# Altium project BATT_ctrl_v3.PrjPcb
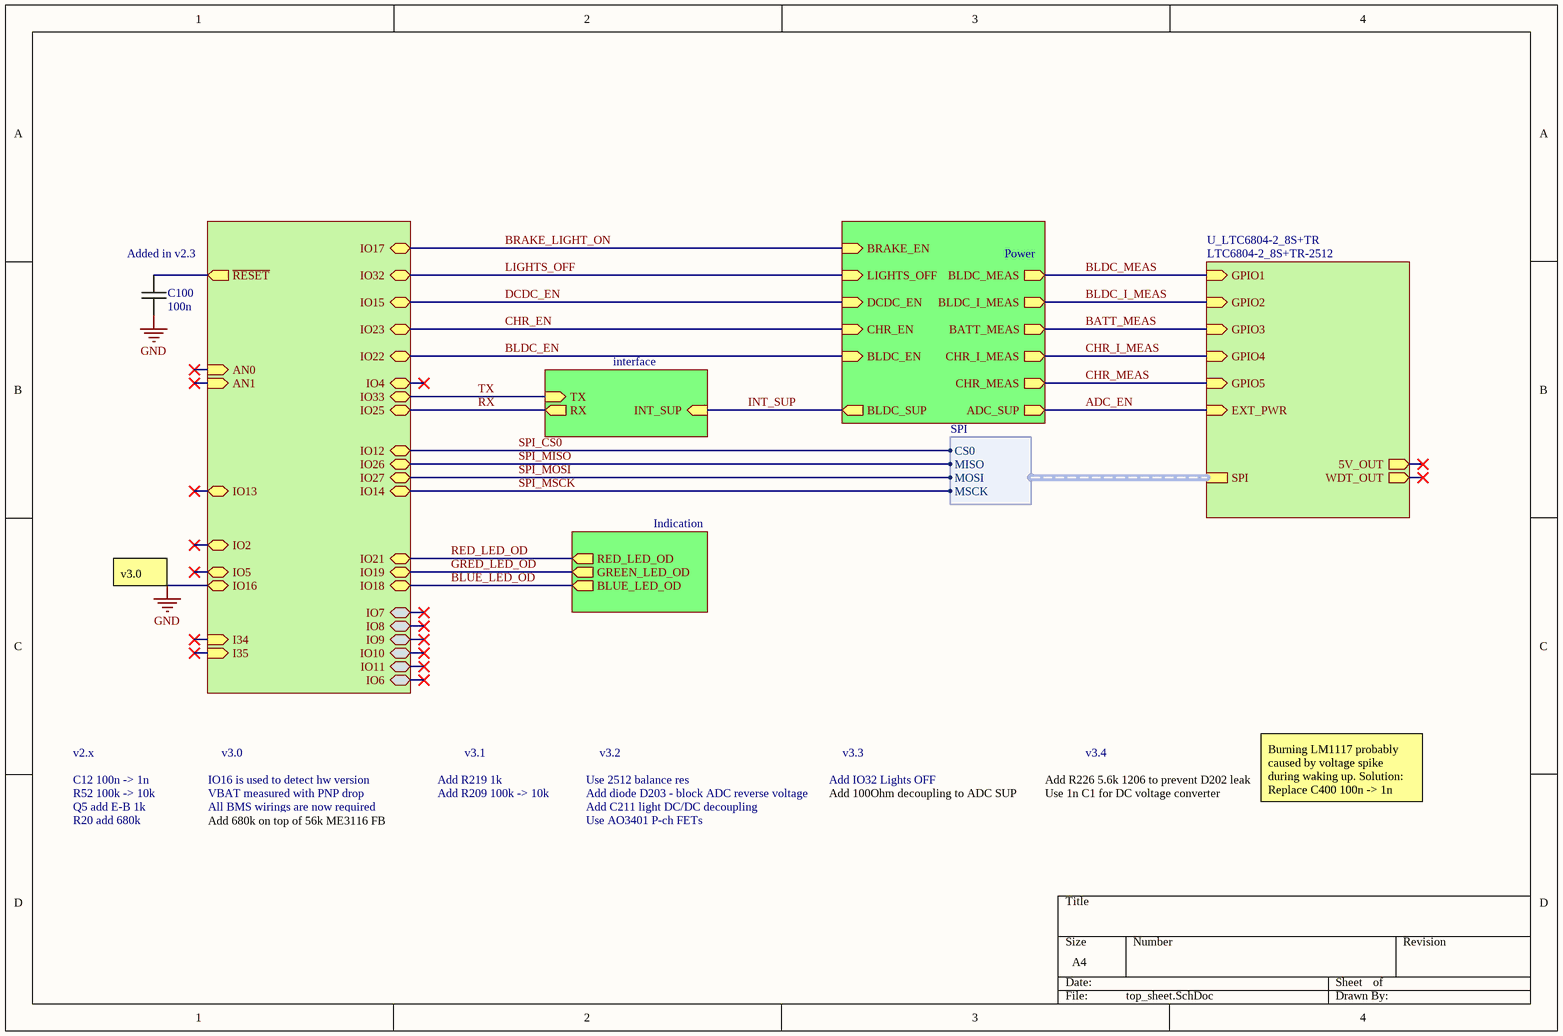
[diagram p0: top_sheet.SchDoc]
5 sheets, 78 parts. Net scope: hierarchical (ports join the sheet entries above them; power ports are global).
Board file: batt_ctrl_pcb_v3.4.PcbDoc
Sheets:
  top_sheet.SchDoc
    Power = power.SchDoc
    interface = data_interface.SchDoc
    Indication = indication.SchDoc
  OveralSchematic.SchDoc

## Sheet top_sheet.SchDoc
size A4; SheetNumber: 1; SheetTotal: 8

### Parts
C100  100n  [CAPC0603(1608)55_N]

### Sub-sheets
Indication = indication.SchDoc: RED_LED_OD (out), GREEN_LED_OD (out), BLUE_LED_OD (out)
interface = data_interface.SchDoc: TX (in), RX (out), INT_SUP (in)
Power = power.SchDoc: BLDC_EN (in), BLDC_I_MEAS (out), CHR_EN (in), CHR_I_MEAS (out), BLDC_MEAS (out), CHR_MEAS (out), BATT_MEAS (out), DCDC_EN (in), BLDC_SUP (out), ADC_SUP (out), LIGHTS_OFF (in), BRAKE_EN (in)
U_ESP32_WROOM2 = ESP32_WROOM2 (file not in this document): IO25 (bidir), IO26 (bidir), IO27 (bidir), IO22 (bidir), IO23 (bidir), IO32 (bidir), IO19 (bidir), IO21 (bidir), IO33 (bidir), IO14 (bidir), IO12 (bidir), IO15 (bidir), IO16 (bidir), IO17 (bidir), IO18 (bidir), IO13 (bidir), I34 (in), I35 (in), IO5 (bidir), IO4 (bidir), IO2 (bidir), AN0 (in), AN1 (in), IO7 (bidir), IO8 (bidir), IO9 (bidir), IO10 (bidir), IO11 (bidir), IO6 (bidir), ~{RESET} (out)
U_LTC6804-2_8S+TR = LTC6804-2_8S+TR-2512 (file not in this document): GPIO1 (in), GPIO2 (in), GPIO3 (in), GPIO4 (in), GPIO5 (in), SPI (harness SPI), EXT_PWR (in), 5V_OUT (out), WDT_OUT (out)

### Harnesses
SPI: CS0, MISO, MOSI, MSCK

### Nets
GND: C100.2 ; sheet U_ESP32_WROOM2/IO16
ADC_EN: sheet Power/BLDC_SUP, sheet Power/ADC_SUP, sheet interface/INT_SUP, sheet U_LTC6804-2_8S+TR/EXT_PWR  [also labelled INT_SUP]
BATT_MEAS: sheet Power/BATT_MEAS, sheet U_LTC6804-2_8S+TR/GPIO3
BLDC_EN: sheet U_ESP32_WROOM2/IO22, sheet Power/BLDC_EN
BLDC_I_MEAS: sheet Power/BLDC_I_MEAS, sheet U_LTC6804-2_8S+TR/GPIO2
BLDC_MEAS: sheet Power/BLDC_MEAS, sheet U_LTC6804-2_8S+TR/GPIO1
BLUE_LED_OD: sheet U_ESP32_WROOM2/IO18, sheet Indication/BLUE_LED_OD
BRAKE_LIGHT_ON: sheet U_ESP32_WROOM2/IO17, sheet Power/BRAKE_EN
CHR_EN: sheet U_ESP32_WROOM2/IO23, sheet Power/CHR_EN
CHR_I_MEAS: sheet Power/CHR_I_MEAS, sheet U_LTC6804-2_8S+TR/GPIO4
CHR_MEAS: sheet Power/CHR_MEAS, sheet U_LTC6804-2_8S+TR/GPIO5
DCDC_EN: sheet U_ESP32_WROOM2/IO15, sheet Power/DCDC_EN
GRED_LED_OD: sheet U_ESP32_WROOM2/IO19, sheet Indication/GREEN_LED_OD
LIGHTS_OFF: sheet U_ESP32_WROOM2/IO32, sheet Power/LIGHTS_OFF
RED_LED_OD: sheet U_ESP32_WROOM2/IO21, sheet Indication/RED_LED_OD
RX: sheet U_ESP32_WROOM2/IO25, sheet interface/RX
SPI_CS0: sheet U_ESP32_WROOM2/IO12, sheet U_LTC6804-2_8S+TR/SPI.CS0
SPI_MISO: sheet U_ESP32_WROOM2/IO26, sheet U_LTC6804-2_8S+TR/SPI.MISO
SPI_MOSI: sheet U_ESP32_WROOM2/IO27, sheet U_LTC6804-2_8S+TR/SPI.MOSI
SPI_MSCK: sheet U_ESP32_WROOM2/IO14, sheet U_LTC6804-2_8S+TR/SPI.MSCK
TX: sheet U_ESP32_WROOM2/IO33, sheet interface/TX
NetC100_1: C100.1 ; sheet U_ESP32_WROOM2/~{RESET}

### Notes on the sheet
- (near C100) Added in v2.3
- v3.0
- v2.x
- C12 100n -> 1n
- IO16 is used to detect hw version
- Add R219 1k
- v3.1
- Use 2512 balance res
- v3.2
- Add IO32 Lights OFF
- v3.3
- Add R226 5.6k 1206 to prevent D202 leak
- v3.4
- R52 100k -> 10k
- Q5 add E-B 1k
- R20 add 680k
- VBAT measured with PNP drop
- All BMS wirings are now required
- Add 680k on top of 56k ME3116 FB
- Add R209 100k -> 10k
- Add diode D203 - block ADC reverse voltage
- Add C211 light DC/DC decoupling
- Use AO3401 P-ch FETs
- Add 100Ohm decoupling to ADC SUP
- Use 1n C1 for DC voltage converter
- Burning LM1117 probably caused by voltage spike during waking up. Solution: Replace C400 100n -> 1n

### Library data of the parts
C100 = Capacitor M: Ceramic capacitor Medium density; Value: 100n

## Sheet power.SchDoc
size A4; SheetNumber: 2; SheetTotal: 8
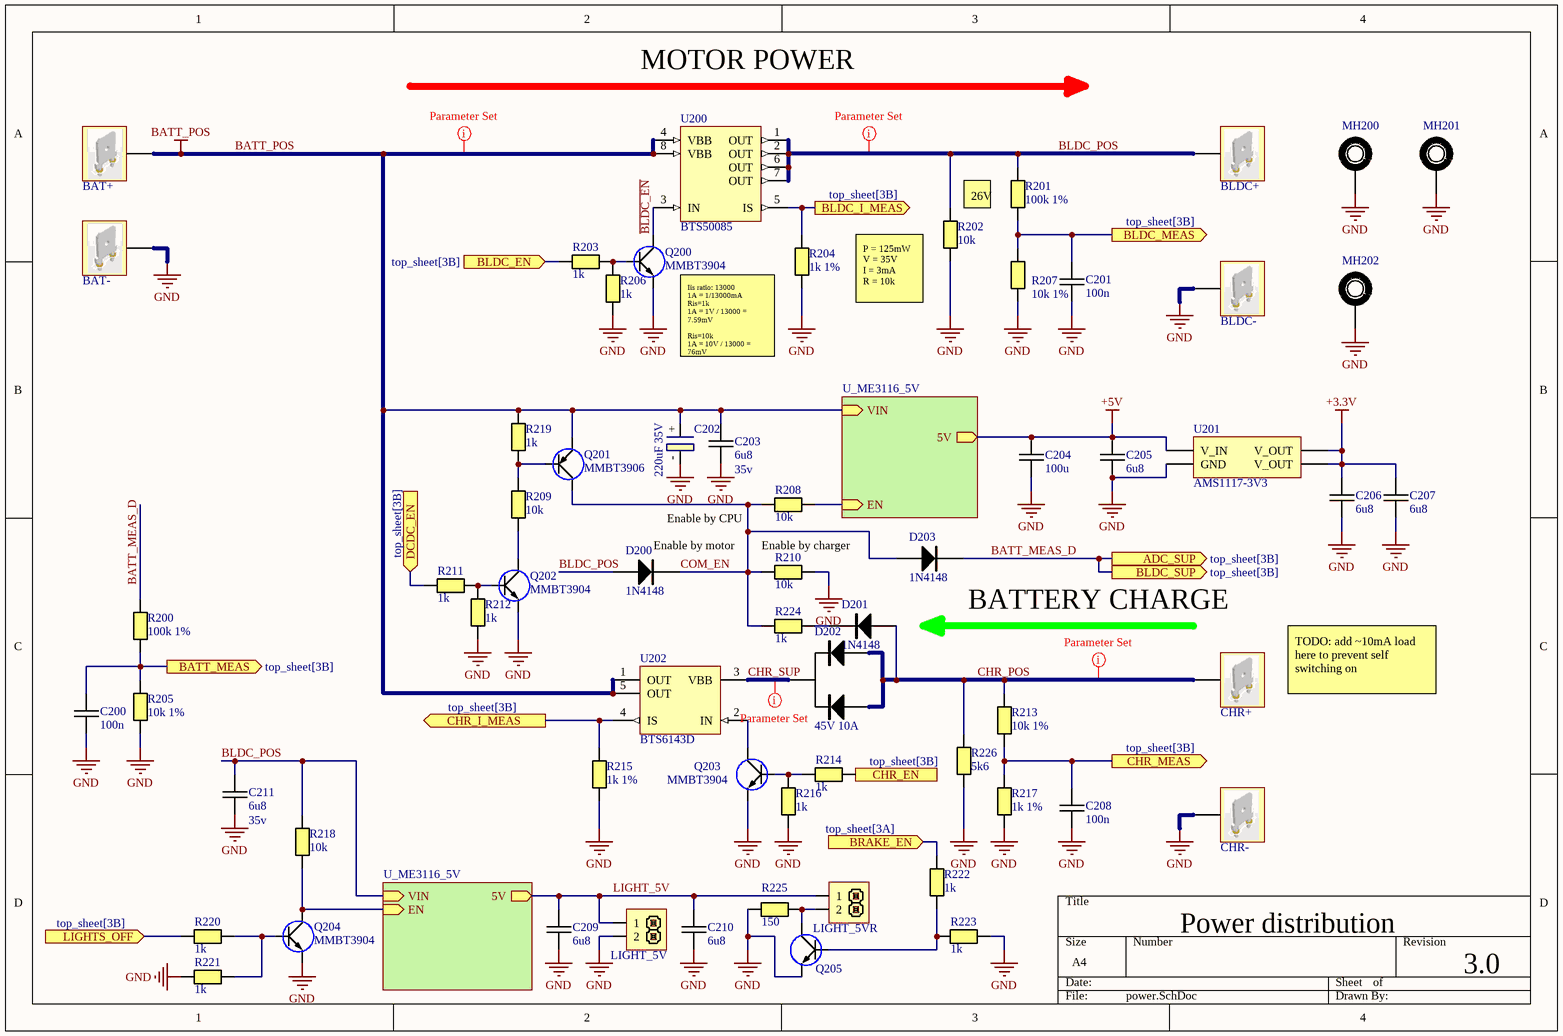
[diagram p1: power.SchDoc]

### Parts
BAT+  Crimp 6.3 single PCB  [Crimp 6.3mm single PCB]  (value not drawn)
BAT-  Crimp 6.3 single PCB  [Crimp 6.3mm single PCB]  (value not drawn)
BLDC+  Crimp 6.3 single PCB  [Crimp 6.3mm single PCB]  (value not drawn)
BLDC-  Crimp 6.3 single PCB  [Crimp 6.3mm single PCB]  (value not drawn)
C200  100n  [CAPC0603(1608)55_N]
C201  100n  [CAPC0603(1608)55_N]
C202  220uF 35V  [10x10.5 Capacitor]
C203  Vmax: 35v  [CAPC0805(2012)75_N]  (hidden comment: 6u8)
C204  100u  [CAPC1206(3216)75_N]
C205  6u8  [CAPC0805(2012)75_N]
C206  6u8  [CAPC0805(2012)75_N]
C207  6u8  [CAPC0805(2012)75_N]
C208  100n  [CAPC0603(1608)55_N]
C209  6u8  [CAPC0805(2012)75_N]
C210  6u8  [CAPC0805(2012)75_N]
C211  Vmax: 35v  [CAPC0805(2012)75_N]  (hidden comment: 6u8)
CHR+  Crimp 6.3 single PCB  [Crimp 6.3mm single PCB]  (value not drawn)
CHR-  Crimp 6.3 single PCB  [Crimp 6.3mm single PCB]  (value not drawn)
CN200  PIN HEADER 1x2  [XH2.54 2P]  (value not drawn)
CN201  Parameter 1: LIGHT_5VR  [XH2.54 2P]  (hidden comment: PIN HEADER 1x2)
D200  1N4148  [SOD80]
D201  1N4148  [SOD80]
D202  45V 10A  [DPAK]
D203  1N4148  [SOD80]
MH200  Mounting Hole  [MH_M3]  (value not drawn)
MH201  Mounting Hole  [MH_M3]  (value not drawn)
MH202  Mounting Hole  [MH_M3]  (value not drawn)
Q200  MMBT3904  [SOT23]
Q201  MMBT3906  [SOT23]
Q202  MMBT3904  [SOT23]
Q203  MMBT3904  [SOT23]
Q204  MMBT3904  [SOT23]
Q205  MMBT3904  [SOT23]  (value not drawn)
R200  100k 1%  [RESC0603(1608)_N]
R201  100k 1%  [RESC0603(1608)_N]
R202  10k  [RESC0805(2012)_N]
R203  1k  [RESC0603(1608)_N]
R204  1k 1%  [RESC0603(1608)_N]
R205  10k 1%  [RESC0603(1608)_N]
R206  1k  [RESC0603(1608)_N]
R207  10k 1%  [RESC0603(1608)_N]
R208  10k  [RESC0603(1608)_N]
R209  10k  [RESC0603(1608)_N]
R210  10k  [RESC0603(1608)_N]
R211  1k  [RESC0603(1608)_N]
R212  1k  [RESC0603(1608)_N]
R213  10k 1%  [RESC0603(1608)_N]
R214  1k  [RESC0603(1608)_N]
R215  1k 1%  [RESC0603(1608)_N]
R216  1k  [RESC0603(1608)_N]
R217  1k 1%  [RESC0603(1608)_N]
R218  10k  [RESC0603(1608)_N]
R219  1k  [RESC0603(1608)_N]
R220  1k  [RESC0603(1608)_N]
R221  1k  [RESC0603(1608)_N]
R222  1k  [RESC0603(1608)_N]
R223  1k  [RESC0603(1608)_N]
R224  1k  [RESC0603(1608)_N]
R225  150  [RESC0805(2012)_N]
R226  5k6  [RESC1206(3216)_N]
U200  BTS50085  [PG-TO220-7-4]
U201  AMS1117-3V3  [SOT229P700X180-4N]
U202  BTS6143D  [ITO252-5-11_M]

### Sub-sheets
U_ME3116_5V = ME3116_5V (file not in this document): EN (in), VIN (in), 5V (out)
U_ME3116_5V = ME3116_5V (file not in this document): EN (in), VIN (in), 5V (out)

### Ports
ADC_SUP (out, see top_sheet[3B]), BATT_MEAS (out, see top_sheet[3B]), BLDC_EN (in, see top_sheet[3B]), BLDC_I_MEAS (out, see top_sheet[3B]), BLDC_MEAS (out, see top_sheet[3B]), BLDC_SUP (out, see top_sheet[3B]), BRAKE_EN (in, see top_sheet[3A]), CHR_EN (in, see top_sheet[3B]), CHR_I_MEAS (out, see top_sheet[3B]), CHR_MEAS (out, see top_sheet[3B]), DCDC_EN (in, see top_sheet[3B]), LIGHTS_OFF (in, see top_sheet[3B])

### Nets
+3.3V: C206.1 C207.1 U201.2(V_OUT) U201.4(V_OUT)
+5V: C204.1 C205.1 U201.3(V_IN) ; sheet U_ME3116_5V/5V
BATT_POS: BAT+.1 C202.+ C203.2 Q201.2(E) R219.2 U200.4(VBB) U200.8(VBB) U202.1(OUT) U202.5(OUT) ; sheet U_ME3116_5V/VIN
GND: BAT-.1 BLDC-.1 C200.2 C201.2 C202.- C203.1 C204.2 C205.2 C206.2 C207.2 C208.2 C209.2 C210.2 C211.2 CHR-.1 CN200.2 MH200.1 MH201.1 MH202.1 Q200.2(E) Q202.2(E) Q203.2(E) Q204.2(E) Q205.2(E) R202.1 R204.1 R205.1 R206.1 R207.1 R210.2 R212.1 R215.1 R216.1 R217.1 R221.2 R223.1 R225.1 R226.1 U201.1(GND)
~{BLDC_EN}: Q200.3(C) U200.3(IN)
BATT_MEAS: C200.1 R200.1 R205.2 ; port BATT_MEAS
BATT_MEAS_D: D203.2(K) R200.2 ; port ADC_SUP, port BLDC_SUP  [project net ADC_EN]
BLDC_EN: R203.1 ; port BLDC_EN
BLDC_I_MEAS: R204.2 U200.5(IS) ; port BLDC_I_MEAS
BLDC_MEAS: C201.1 R201.1 R207.2 ; port BLDC_MEAS
BLDC_POS: BLDC+.1 C211.1 D200.1(A) R201.2 R202.2 R218.2 U200.1(OUT) U200.2(OUT) U200.6(OUT) U200.7(OUT) ; sheet U_ME3116_5V/VIN
BRAKE_LIGHT_ON: R222.1 ; port BRAKE_EN
CHR_EN: R214.1 ; port CHR_EN
CHR_I_MEAS: R215.2 U202.4(IS) ; port CHR_I_MEAS
CHR_MEAS: C208.1 R213.1 R217.2 ; port CHR_MEAS
CHR_POS: CHR+.1 D201.1(A) D202.1(A1) D202.3(A2) R213.2 R226.2
CHR_SUP: D202.2(K) U202.3(VBB)
COM_EN: D200.2(K) D203.1(A) Q201.3(C) R208.2 R210.1 R224.2
DCDC_EN: R211.1 ; port DCDC_EN
LIGHT_5V: C209.1 C210.1 CN200.1 CN201.1 ; sheet U_ME3116_5V/5V
LIGHTS_OFF: R220.2 ; port LIGHTS_OFF
NetCN201_2: CN201.2 Q205.3(C) R225.2
NetD201_2: D201.2(K) R224.1
NetQ200_1: Q200.1(B) R203.2 R206.2
NetQ201_1: Q201.1(B) R209.1 R219.1
NetQ202_1: Q202.1(B) R211.2 R212.2
NetQ202_3: Q202.3(C) R209.2
NetQ203_1: Q203.1(B) R214.2 R216.2
NetQ203_3: Q203.3(C) U202.2(IN)
NetQ204_1: Q204.1(B) R220.1 R221.1
NetQ204_3: Q204.3(C) R218.1 ; sheet U_ME3116_5V/EN
NetQ205_1: Q205.1(B) R222.2 R223.2
NetR208_1: R208.1 ; sheet U_ME3116_5V/EN

### Layout directives
net class Direct; net class HV: BATT_POS, BLDC_POS, CHR_POS, CHR_SUP

### Notes on the sheet
- MOTOR POWER
- 26V / 10k = 2.6mA
  2.6 * 26 = 67mW
- (near R202) P = 125mW
  V = 35V
  I = 3mA
  R = 10k
- Iis ratio: 13000
  1A = 1/13000mA
  Ris=1k
  1A = 1V / 13000 = 7.59mV
  Ris=10k
  1A = 10V / 13000 = 76mV
- Enable by CPU
- (near D200) Enable by motor
- Enable by charger
- BATTERY CHARGE
- TODO: add ~10mA load here to prevent self switching on
- Power distribution
- 3.0

### Library data of the parts
BAT+ BAT- BLDC+ BLDC- CHR+ CHR- = Crimp 6.3 single PCB: Straight Mount Angle PCB Tab Terminal
  BAT- BLDC- CHR-: ClassName: DirectGND
C200 C201 C203-C211 = Capacitor M: Ceramic capacitor Medium density
  C200 C201 C208: Value: 100n
  C203 C205-C207 C209-C211: Value: 6u8
  C204: Value: 100u
C202 = Capacitor Electrolitic: Value: 220uF 35V
CN200 CN201 = PIN HEADER 2.54 1x2: LIGHT_5V
  CN200: Parameter 1: LIGHT_5V
D200 D201 D203 = 1N4148: Small Signal Fast Switching Diodes; Repetitive peak reverse voltage: 100 V; Reverse voltage: 75 V; Peak forward surge current: 2 A; Repetitive peak forward current: 500 mA; Forward continuous current: 300 mA; Average forward current: 150 mA; Diode capacitance: 4 pF; Reverse recovery time: 4 ~ 8 ns; Supplier 1: Mouser; Supplier Part Number 1: 78-MCL4148
D202 = STPS1045B: Power schottky rectifier; V: 45V; I: 10A
Q200 Q202-Q205 = 2N3904: NPN General Purpose Transistor; Collector-Emitter Voltage: 40V; Collector-Base Voltage: 60V; Collector Current - Continuous: 200mA; DC Current Gain: 300
Q201 = 2N3906: PNP General Purpose Transistor; Collector-Emitter Voltage: -40V; Collector-Base Voltage: -60V; Collector Current - Continuous: 200mA; DC Current Gain: 300
R200-R226 = Resistor M: Resistor Medium Density
  R200 R201: Value: 100k 1%
  R202 R208-R210 R218: Value: 10k
  R203 R206 R211 R212 R214 R216 R219-R224: Value: 1k
  R204 R215 R217: Value: 1k 1%
  R205 R207 R213: Value: 10k 1%
  R225: Value: 150
  R226: Value: 5k6
U200 = BTS50085-1TMA: Smart Highside High Current Power Switch; Overvoltage protection: 70V; Output clamp: 62V; Operating voltage: 5.0 .. 58V; On-state resistance: 9 mOhm; Load current (ISO): 44A; Short circuit current limitation: 90A; Current sense ratio: 13000
U201 = AMS1117: 800mA LDO  15V max
U202 = BTS6143D: PROFET Smart Highside Power Switch, 1 Channel, 10 A Load Current, -40 to 150 degC, PG-TO252-5-11, Reel, Green; Manufacturer: Infineon; Recommended Operating Voltage Min.: 5.5 V; RON(max) @ 150degreesC: 18 mOhm; toff (max): 500 us; Load Current (typ): 10 A; RON @ 25degreesC: 10 mOhm; Recommended Operating Voltage Max.: 38 V; Green: TRUE; Ptot (max): 59 W; Group: Automotive Qualified; Channels: 1; Packing: Reel; ComponentLink1URL: http://www.infineon.com/; PartNumber: BTS6143D; Mounting Technology: Surface Mount; ComponentLink2Description: Datasheet; ComponentLink3URL: http://www.infineon.com/dgdl/TLE7276-Data+Sheet-+v1_11.pdf?folderId=db3a304412b407950112b408e8c90004&fileId=db3a304412b407950112b436c53f66c8&sId=db3a30433db6f09f013dc0e43c0428c1; ComponentLink3Description: Package Specification; ComponentLink2URL: http://www.infineon.com/dgdl/BTS6143D_DS_v10.pdf?folderId=db3a304314dca389011537739e37155f&fileId=db3a3043183a95550118606a2705368e&location=en.Products.Automotive_ICs.Smart_High-_and_Low-Side_Switches.PROFET__-_Smart_High_Side_Switches.DATASHEET.BTS6143D_D; ComponentLink1Description: Manufacturer URL; PackageVersion: Nov-10; PackageDescription: 5-Pin Plastic (Green) Transistor Single Outline Package, 6.5 x 6.12 mm Body, 1.14 mm Pitch; Halogen-free: TRUE; DatasheetVersion: Rev. 1.0; PackageReference: PG-TO252-5-11; ton (max): 500 us
MH200-MH202 = Mounting Hole: ClassName: DirectGND

## Sheet data_interface.SchDoc
size A4; SheetNumber: 3; SheetTotal: 7
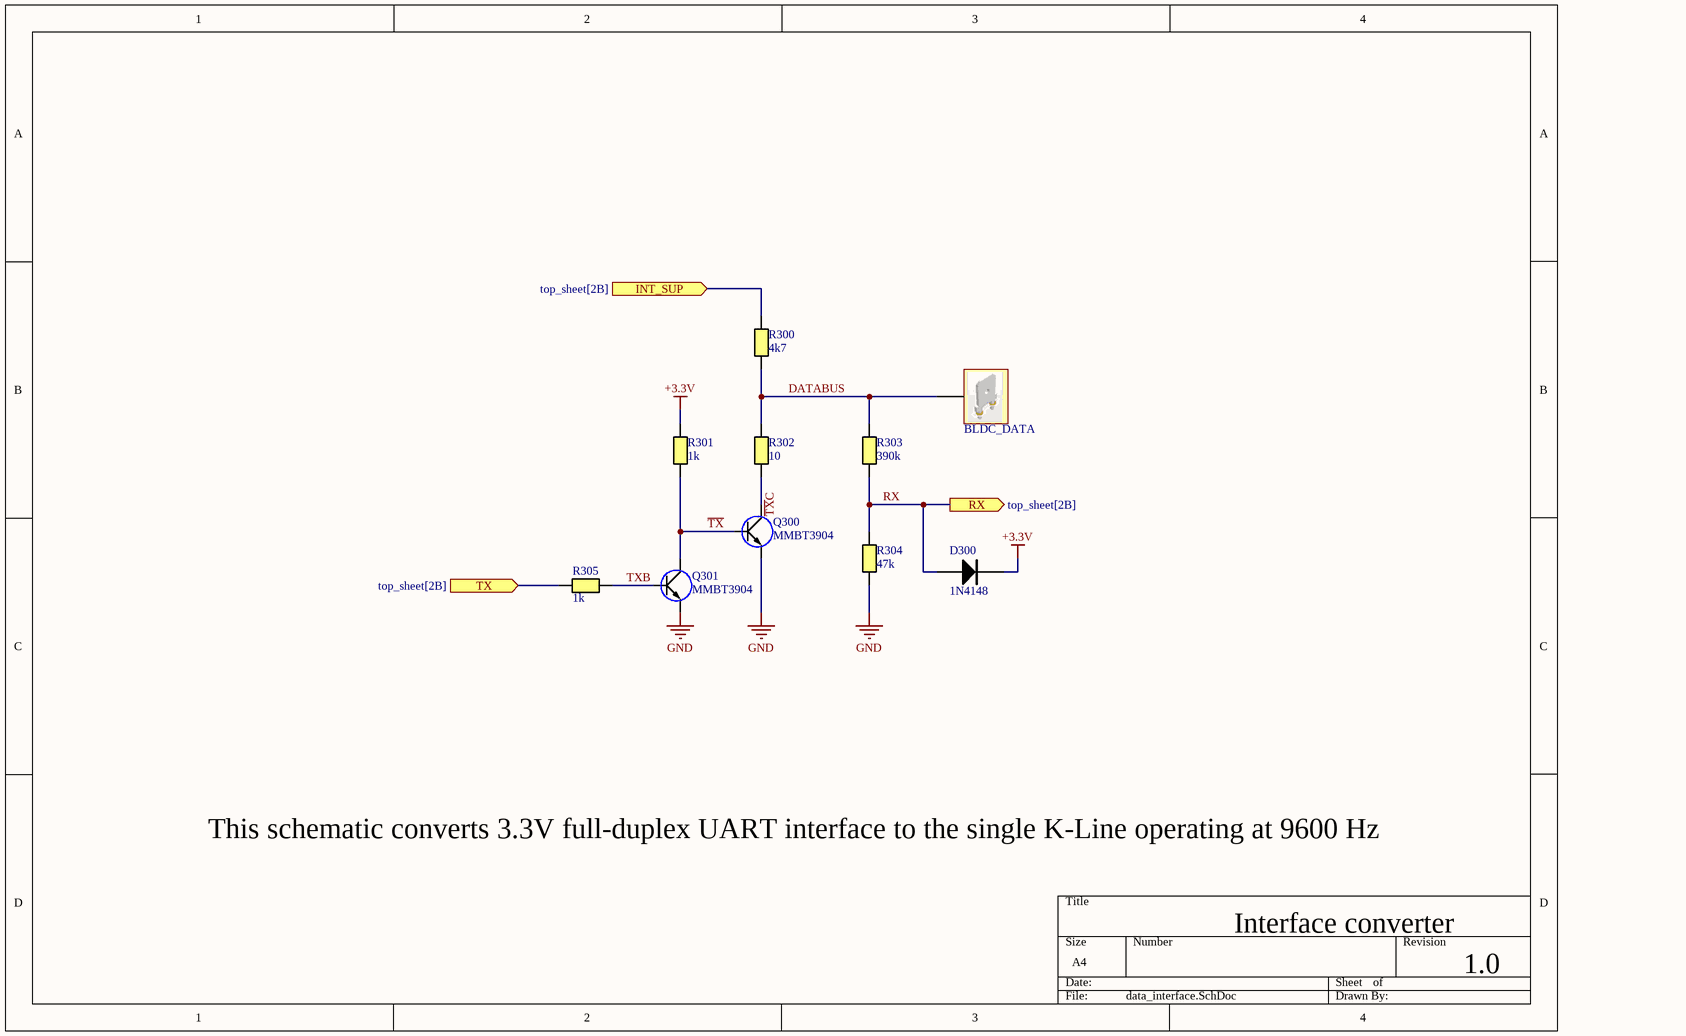
[diagram p2: data_interface.SchDoc]

### Parts
BLDC_DATA  Crimp 6.3 single PCB  [Crimp 6.3mm single PCB]  (value not drawn)
D300  1N4148  [SOD80]
Q300  MMBT3904  [SOT23]
Q301  MMBT3904  [SOT23]
R300  4k7  [RESC0603(1608)_N]
R301  1k  [RESC0603(1608)_N]
R302  10  [RESC0603(1608)_N]
R303  390k  [RESC0603(1608)_N]
R304  47k  [RESC0603(1608)_N]
R305  1k  [RESC0603(1608)_N]

### Ports
INT_SUP (in, see top_sheet[2B]), RX (out, see top_sheet[2B]), TX (in, see top_sheet[2B])

### Nets
+3.3V: D300.2(K) R301.2
GND: Q300.2(E) Q301.2(E) R304.1
ADC_EN: R300.2 ; port INT_SUP
DATABUS: BLDC_DATA.1 R300.1 R302.2 R303.2
RX: D300.1(A) R303.1 R304.2 ; port RX
~{TX}: Q300.1(B) Q301.3(C) R301.1
~{TX}C: Q300.3(C) R302.1
TX: R305.1 ; port TX
TXB: Q301.1(B) R305.2

### Notes on the sheet
- This schematic converts 3.3V full-duplex UART interface to the single K-Line operating at 9600 Hz
- Interface converter
- 1.0

### Library data of the parts
BLDC_DATA = Crimp 6.3 single PCB: Straight Mount Angle PCB Tab Terminal
D300 = 1N4148: as D200 on sheet power; Supplier 1: Mouser; Supplier Part Number 1: 78-MCL4148
Q300 Q301 = 2N3904: as Q200 on sheet power
R300-R305 = Resistor M: Resistor Medium Density
  R300: Value: 4k7
  R301 R305: Value: 1k
  R302: Value: 10
  R303: Value: 390k
  R304: Value: 47k

## Sheet indication.SchDoc
size A4; SheetNumber: 4; SheetTotal: 7
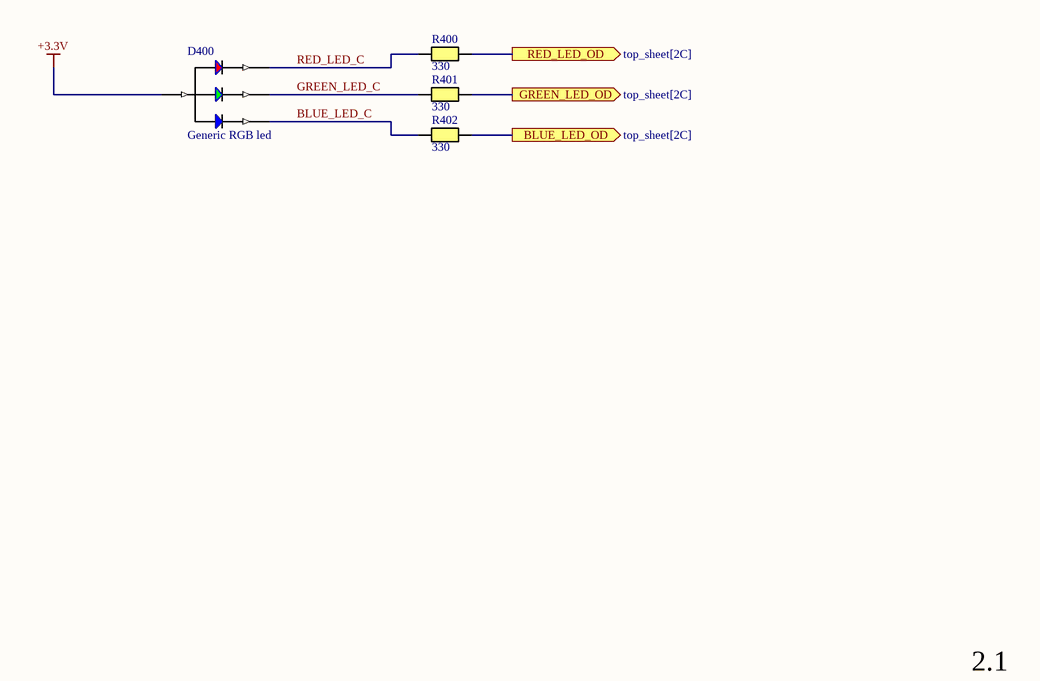
[diagram p3: indication.SchDoc]

### Parts
D400  Generic RGB led  [RGB throu hole 90 deg]
R400  330  [RESC0603(1608)_N]
R401  330  [RESC0603(1608)_N]
R402  330  [RESC0603(1608)_N]

### Ports
BLUE_LED_OD (out, see top_sheet[2C]), GREEN_LED_OD (out, see top_sheet[2C]), RED_LED_OD (out, see top_sheet[2C])

### Nets
+3.3V: D400.CA
BLUE_LED_C: D400.BC R402.1
BLUE_LED_OD: R402.2 ; port BLUE_LED_OD
GRED_LED_OD: R401.2 ; port GREEN_LED_OD
GREEN_LED_C: D400.GC R401.1
RED_LED_C: D400.RC R400.1
RED_LED_OD: R400.2 ; port RED_LED_OD

### Notes on the sheet
- 2.1

### Library data of the parts
D400 = RGB led
R400-R402 = Resistor M: Resistor Medium Density; Value: 330

## Sheet OveralSchematic.SchDoc
size A4; SheetNumber: 5; SheetTotal: 8
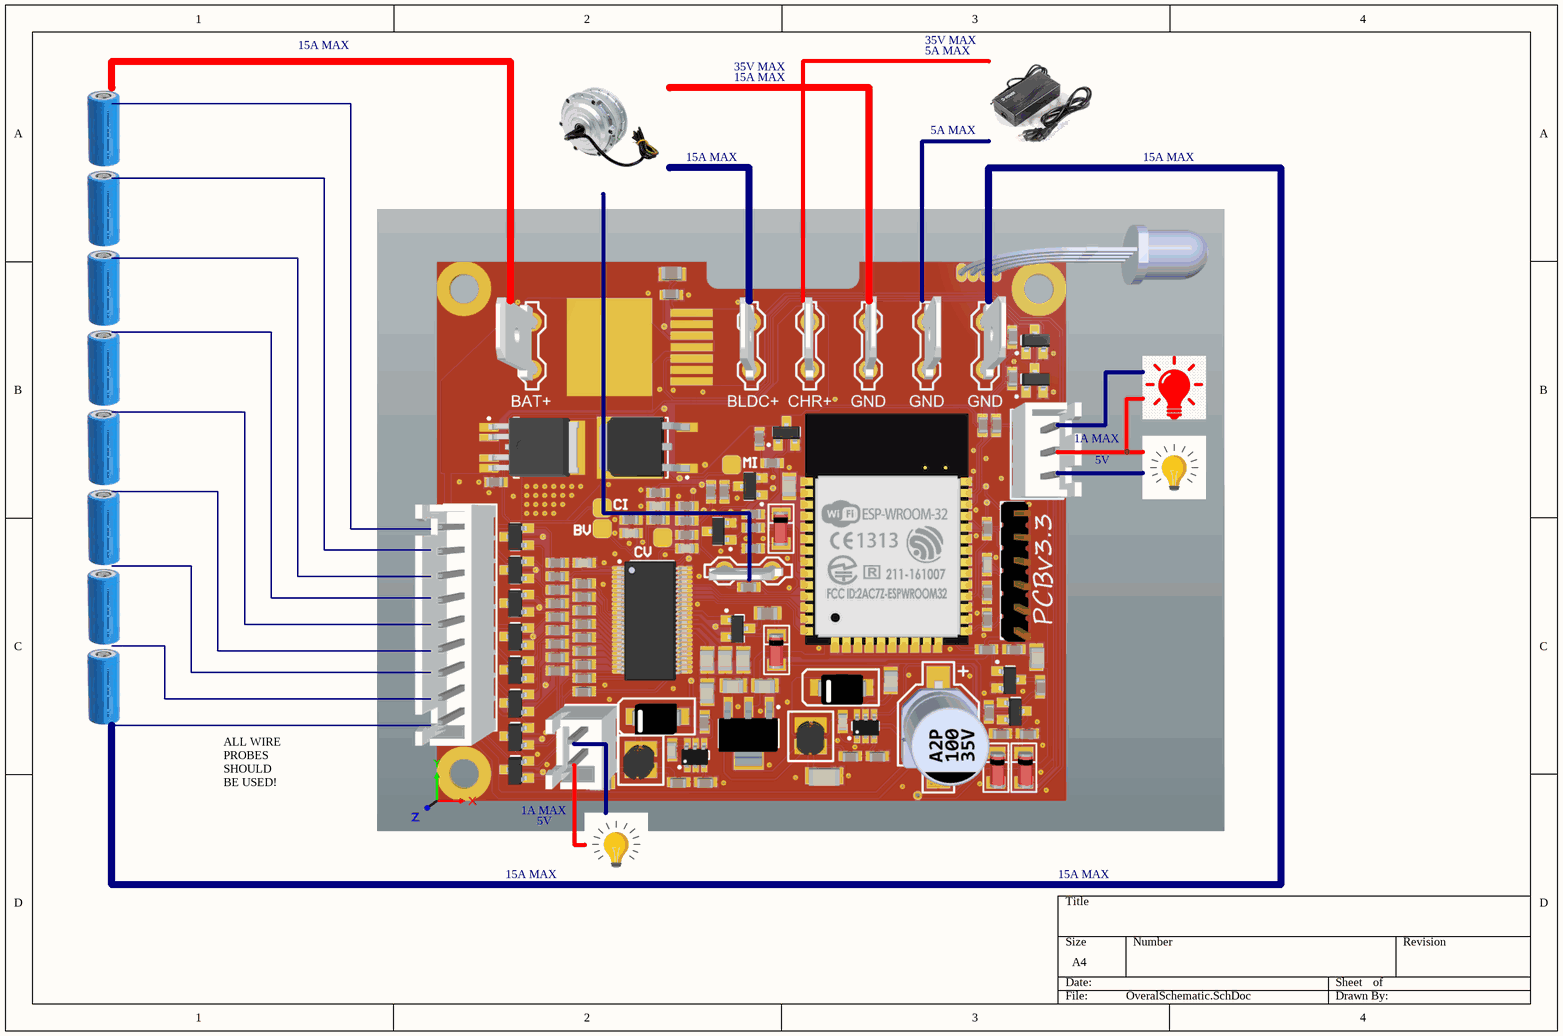
[diagram p4: OveralSchematic.SchDoc]

### Notes on the sheet
- 35V MAX
- 15A MAX
- 5A MAX
- 1A MAX
- 5V
- ALL WIRE PROBES SHOULD BE USED!

## Nets that join several sheets
+3.3V: power (C206.1 C207.1 U201.2 U201.4), data_interface (D300.2 R301.2), indication (D400.CA)
GND: top_sheet (C100.2), power (39 pins), data_interface (Q300.2 Q301.2 R304.1)
ADC_EN: power (D203.2 R200.2), data_interface (R300.2)

## Assembly variants
BATT_ctrl_v3.3 bare minimum: not fitted D600 Q204 Q205 R220 R221 R223 R224 R600 R601 R602